# Altium schematic sheet Power Distribution - Roof Enclosure.SchDoc: Outputs to Roof Enclosure
size Letter; Organization: Midnight Sun Solar Rayce Car Team; Address1: University of Waterloo; Address2: 200 University Ave W; Address3: Waterloo, ON, Canada; Address4: N2L 3E9; DocumentNumber: 8; SheetNumber: 8; SheetTotal: 10; Website: www.uwmidsun.com
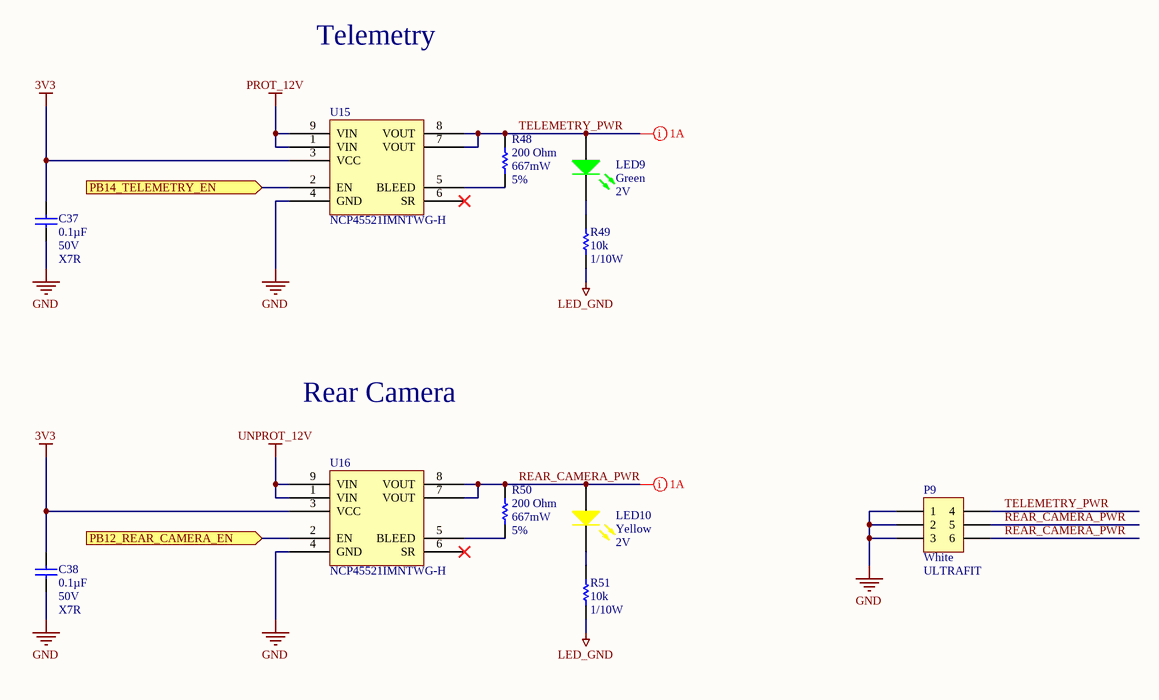
[diagram p0: Power Distribution - Roof Enclosure.SchDoc]

## Parts
C37  Capacitance: 0.1µF  Voltage: 50V  Temperature Coefficient: X7R  [CAP, 0603]  (hidden comment: CAP CER 0.1UF 50V 10% X7R 0603)
C38  Capacitance: 0.1µF  Voltage: 50V  Temperature Coefficient: X7R  [CAP, 0603]  (hidden comment: CAP CER 0.1UF 50V 10% X7R 0603)
LED9  Color: Green  Voltage - Forward (Vf) (Typ): 2V  [LED_0603]  (hidden comment: LED GREEN CLEAR 2V 0603)
LED10  Color: Yellow  Voltage - Forward (Vf) (Typ): 2V  [LED_0603]  (hidden comment: LED YELLOW CLEAR 2.1V 0603)
P9  Insulation Color: White  Series: ULTRAFIT  [CONN, 6POS ULTRA-FIT - NATURAL COLOR]  (hidden comment: CONN 6POS ULTRA-FIT NATURAL COLOR 0.138")
R48  200 Ohm  Tolerance: 5%  Max Power Dissipation: 667mW  [RES 1206]
R49  Resistance: 10k  Power: 1/10W  [RES, 0603]  (hidden comment: RES 10K OHM 1% 1/10W 0603)
R50  200 Ohm  Tolerance: 5%  Max Power Dissipation: 667mW  [RES 1206]
R51  Resistance: 10k  Power: 1/10W  [RES, 0603]  (hidden comment: RES 10K OHM 1% 1/10W 0603)
U15  IC LOAD SWITCH ACT-HI 10.5A 8DFN  [IC LOAD SWITCH ACT-HI 10.5A 8DFN]  (value not drawn)
U16  IC LOAD SWITCH ACT-HI 10.5A 8DFN  [IC LOAD SWITCH ACT-HI 10.5A 8DFN]  (value not drawn)

## Ports
PB12_REAR_CAMERA_EN (in), PB14_TELEMETRY_EN (in)

## Nets
3V3: C37.1 C38.1 U15.3(VCC) U16.3(VCC)
GND: C37.2 C38.2 P9.1 P9.2 P9.3 U15.4(GND) U16.4(GND)
LED_GND: R49.2 R51.2
PROT_12V: U15.1(VIN) U15.9(VIN)
UNPROT_12V: U16.1(VIN) U16.9(VIN)
PB12_REAR_CAMERA_EN: U16.2(EN) ; port PB12_REAR_CAMERA_EN
PB14_TELEMETRY_EN: U15.2(EN) ; port PB14_TELEMETRY_EN
REAR_CAMERA_PWR: LED10.1(A) P9.5 P9.6 R50.1 U16.7(VOUT) U16.8(VOUT)
TELEMETRY_PWR: LED9.1(A) P9.4 R48.1 U15.7(VOUT) U15.8(VOUT)
NetLED9_2: LED9.2(K) R49.1
NetLED10_2: LED10.2(K) R51.1
NetR48_2: R48.2 U15.5(BLEED)
NetR50_2: R50.2 U16.5(BLEED)

Not connected (* = marked no-connect by the designer): U15 6(SR)*; U16 6(SR)*

## Layout directives
net class HighCurrent; rule Power Plane Connect Style [Style - Direct Connect]; rule Polygon Connect Style [Style - Direct Connect]: REAR_CAMERA_PWR, TELEMETRY_PWR

## Notes on the sheet
- Telemetry
- Rear Camera
- Project:
- Title:
- Size:
- Project Author
- Letter
- Revision:
- University of Waterloo
- 200 University Ave W
- Waterloo, ON, Canada
- N2L 3E9
- Date:
- Sheet
- of
- Website:

## Library data of the parts
C37 C38 = CAP CER 0.1UF 50V 10% X7R 0603: 0.10µF ±10% 50V Ceramic Capacitor X7R 0603 (1608 Metric); Manufacturer 1: AVX Corporation; Manufacturer Part Number 1: 06035C104KAT2A; Supplier 1: Digi-Key; Supplier Part Number 1: 478-5052-1-ND; Packaging: Cut Tape (CT); Part Status: Active; Operating Temperature: -55°C ~ 125°C; Ratings: -; Mounting Type: Surface Mount, MLCC; Package / Case: 0603 (1608 Metric); Size / Dimension: 0.063" L x 0.032" W (1.60mm x 0.81mm); Height - Seated (Max): -; Thickness (Max): 0.035" (0.90mm); Lead Spacing: -; Lead Style: -; ComponentLink1URL: http://datasheets.avx.com/X7RDielectric.pdf; ComponentLink1Description: http://datasheets.avx.com/X7RDielectric.pdf; Tolerance: ±10%
LED9 = LED GREEN CLEAR 2V 0603: Green 572nm LED Indication - Discrete 2V 0603 (1608 Metric); Manufacturer: Wurth Electronics Inc.; Manufacturer Part Number: 150060VS75000; Lens Color: Colorless; Millicandela Rating: 40mcd; Lens Style/Size: Rectangle with Flat Top, 1.10mm x 0.70mm; Current - Test: 20mA; Viewing Angle: 140°; Wavelength - Dominant: 570nm; Supplier 1: Digi-Key; RoHS: RoHS Compliant; Category: Optoelectronics; Stock 1: 9408; Pricing 1: 1=0.21, 100=0.1617, 500=0.13964 (CAD); Packaging: Cut Tape (CT); Part Status: Active; Lens Transparency: Clear; Mounting Type: Surface Mount; Wavelength - Peak: 572nm; Features: -; Package / Case: 0603 (1608 Metric); Supplier Device Package: 0603; Size / Dimension: 1.60mm L x 0.80mm W; Height (Max): 0.80mm; ComponentLink1URL: http://katalog.we-online.de/led/datasheet/150060VS75000.pdf; ComponentLink1Description: http://katalog.we-online.de/led/datasheet/150060VS75000.pdf; Supplier Part Number 1: 732-4980-1-ND
LED10 = LED YELLOW CLEAR 2.1V 0603: Yellow 590nm LED Indication - Discrete 2V 0603 (1608 Metric); Manufacturer: Wurth Electronics Inc.; Manufacturer Part Number: 150060YS75000; Lens Color: Colorless; Millicandela Rating: 120mcd; Lens Style/Size: Rectangle with Flat Top, 1.10mm x 0.70mm; Current - Test: 20mA; Viewing Angle: 140°; Wavelength - Peak: 595nm; Supplier 1: Digi-Key; RoHS: RoHS Compliant; Category: Optoelectronics; Stock 1: 10523; Pricing 1: 1=0.21, 100=0.1617, 500=0.13964 (CAD); Packaging: Cut Tape (CT); Part Status: Active; Lens Transparency: Clear; Mounting Type: Surface Mount; Wavelength - Dominant: 590nm; Features: -; Package / Case: 0603 (1608 Metric); Supplier Device Package: 0603; Size / Dimension: 1.60mm L x 0.80mm W; Height (Max): 0.80mm; ComponentLink1URL: http://katalog.we-online.de/led/datasheet/150060YS75000.pdf; ComponentLink1Description: http://katalog.we-online.de/led/datasheet/150060YS75000.pdf; Supplier Part Number 1: 732-4981-1-ND
P9 = CONN 6POS ULTRA-FIT NATURAL COLOR 0.138": 6 Positions Header Connector 0.138" (3.50mm) Through Hole Tin; Manufacturer 1: Molex, LLC; Manufacturer Part Number 1: 1722992106; Description 1: ULTRAFIT VERT TIN PLATED NAT; Style: Board to Cable/Wire; Shrouding: Shrouded - 4 Wall; Number of Positions: 6; Number of Positions Loaded: All; Row Spacing - Mating: 0.181" (4.60mm); Contact Length - Post: 0.126" (3.20mm); Material Flammability Rating: UL94 V-0; Voltage Rating: 400V; Mated Stacking Heights: 26.99mm; Supplier 1: Digi-Key; Supplier Part Number 1: WM11799-ND; RoHS: RoHS Compliant; Category: Connectors, Interconnects; Stock 1: 315; Pricing 1: 1=1.85, 10=1.617, 50=1.4586, 100=1.395, 250=1.26816, 500=1.14134, 1000=1.01453, 2500=0.91942, 5000=0.88771 (CAD); Packaging: Tray; Part Status: Active; Connector Type: Header; Contact Type: Male Pin; Pitch - Mating: 0.138" (3.50mm); Number of Rows: 2; Mounting Type: Through Hole; Termination: Solder; Fastening Type: Latch Holder; Contact Length - Mating: -; Overall Contact Length: -; Insulation Height: 0.465" (11.80mm); Contact Shape: Square; Contact Finish - Mating: Tin; Contact Finish Thickness - Mating: 60µin (1.52µm); Contact Finish - Post: Tin; Contact Material: Copper Alloy; Insulation Material: Liquid Crystal Polymer (LCP); Features: Board Guide, Solder Retention; Operating Temperature: -40°C ~ 105°C; Ingress Protection: -; Current Rating: -; Contact Finish Thickness - Post: 60µin (1.52µm); Applications: Automotive, General Purpose, Industrial, Lighting, Medical, Military, Telecommunications; ComponentLink1URL: http://www.molex.com/pdm_docs/sd/1722992106_sd.pdf; ComponentLink1Description: http://www.molex.com/pdm_docs/sd/1722992106_sd.pdf
R48 R50 = RES 200 OHM 5% 2/3W 1206: 200 Ohms ±5% 0.667W, 2/3W Chip Resistor 1206 (3216 Metric) Automotive AEC-Q200, Pulse Withstanding Thick Film; Manufacturer: Panasonic; Manufacturer Part Number: ERJ-P08J201V; Voltage Rating: 500V; Resistance: 200R; Power Rating: 660mW; Temperature Coefficient: 200ppm/°C; Voltage Rating (DC): 200V; Supplier 1: Digi-Key; Stock 1: 32165; Pricing 1: 1=0.16, 10=0.137, 100=0.0534, 1000=0.02237, 2500=0.02051 (USD); Mount: Surface Mount; Case/Package: 1206; Case Code (Imperial): 1206; Case Code (Metric): 3216; Contact Plating: Tin; Min Operating Temperature: -55°C; Max Operating Temperature: 155°C; Packaging: Tape and Reel; Package Quantity: 1; Termination: SMD/SMT; Composition: Thick Film; Number of Terminations: 2; Length: 3.2mm; Height: 0.028inch; Width: 1.6mm; Radiation Hardening: No; Lead Free: Contains Lead; ComponentLink1URL: https://datasheet.ciiva.com/17207/aoa0000ce4-17207029.pdf; ComponentLink1Description: https://datasheet.ciiva.com/17207/aoa0000ce4-17207029.pdf; ComponentLink2URL: https://datasheet.ciiva.com/9184/aoa0000ce4-9184599.pdf; ComponentLink2Description: https://datasheet.ciiva.com/9184/aoa0000ce4-9184599.pdf; ComponentLink3URL: https://datasheet.ciiva.com/9184/aoa0000ce4-9184603.pdf; ComponentLink3Description: https://datasheet.ciiva.com/9184/aoa0000ce4-9184603.pdf; ComponentLink4URL: https://datasheet.ciiva.com/30201/aoa0000ce4-30201485.pdf; ComponentLink4Description: https://datasheet.ciiva.com/30201/aoa0000ce4-30201485.pdf; Supplier Part Number 1: P200ALCT-ND
R49 R51 = RES 10K OHM 1% 1/10W 0603: RES SMD 10K OHM 1% 1/10W 0603; Manufacturer 1: Yageo; Manufacturer Part Number 1: RC0603FR-0710KL; Temperature Coefficient: ±100ppm/°C; Supplier 1: Digi-Key; Supplier Part Number 1: 311-10.0KHRCT-ND; Packaging: Cut Tape (CT); Part Status: Active; Composition: Thick Film; Operating Temperature: -55°C ~ 155°C; Package / Case: 0603 (1608 Metric); Supplier Device Package: 0603; Size / Dimension: 0.063" L x 0.031" W (1.60mm x 0.80mm); Height - Seated (Max): 0.022" (0.55mm); Failure Rate: -; ComponentLink1URL: http://www.yageo.com/documents/recent/PYu-RC_Group_51_RoHS_L_7.pdf; ComponentLink1Description: http://www.yageo.com/documents/recent/PYu-RC_Group_51_RoHS_L_7.pdf; Tolerance: ±1%
U15 U16 = IC LOAD SWITCH ACT-HI 10.5A 8DFN: NCP45521IMNTWG-H; Manufacturer: ON Semiconductor; Switch Type: General Purpose; Number of Outputs: 1; Ratio - Input:Output: 1:1; Output Configuration: High Side; Output Type: N-Channel; Interface: On/Off; Voltage - Load: 0.5 V ~ 13.5 V; Voltage - Supply (Vcc/Vdd): 3 V ~ 5.5 V; Rds On (Typ): 12.8 mOhm; Input Type: Non-Inverting; Fault Protection: Over Temperature, UVLO; Manufacturer Part Number: NCP45521IMNTWG-H; RoHS: RoHS Compliant; Category: Integrated Circuits (ICs); Packaging: Digi-Reel®; Part Status: Active; Current - Output (Max): 10.5A; Features: Slew Rate Controlled; Operating Temperature: -40°C ~ 85°C (TA); Package / Case: 8-VFDFN Exposed Pad; Supplier Device Package: 8-DFN (2x2); ComponentLink1URL: http://www.onsemi.com/pub/Collateral/NCP45520-D.PDF; ComponentLink1Description: http://www.onsemi.com/pub/Collateral/NCP45520-D.PDF; Supplier 1: Digi-Key; Stock 1: 2377; Pricing 1: 1=1.57, 10=1.405, 100=1.0957, 500=0.90518, 1000=0.71462 (CAD); Supplier 2: Digi-Key; Stock 2: 2211; Pricing 2: 1=1.53, 10=1.372, 100=1.0702, 500=0.88408, 1000=0.69797 (CAD); Supplier Part Number 2: NCP45521IMNTWG-HOSDKR-ND